# EAGLE schematic CFT-PB0-revB (EAGLE 5.11)
DRAWN_BY: Alexios; PROJECT_NAME: CFT Mini-Computer; REVISION: Rev F; SHEET_DESCRIPTION: Microcode Banking; SIMULATION_FILENAME: verification/processor-board-uC.v; URL: http://www.bedroomlan.org/cft

## Sheet 1 of 4
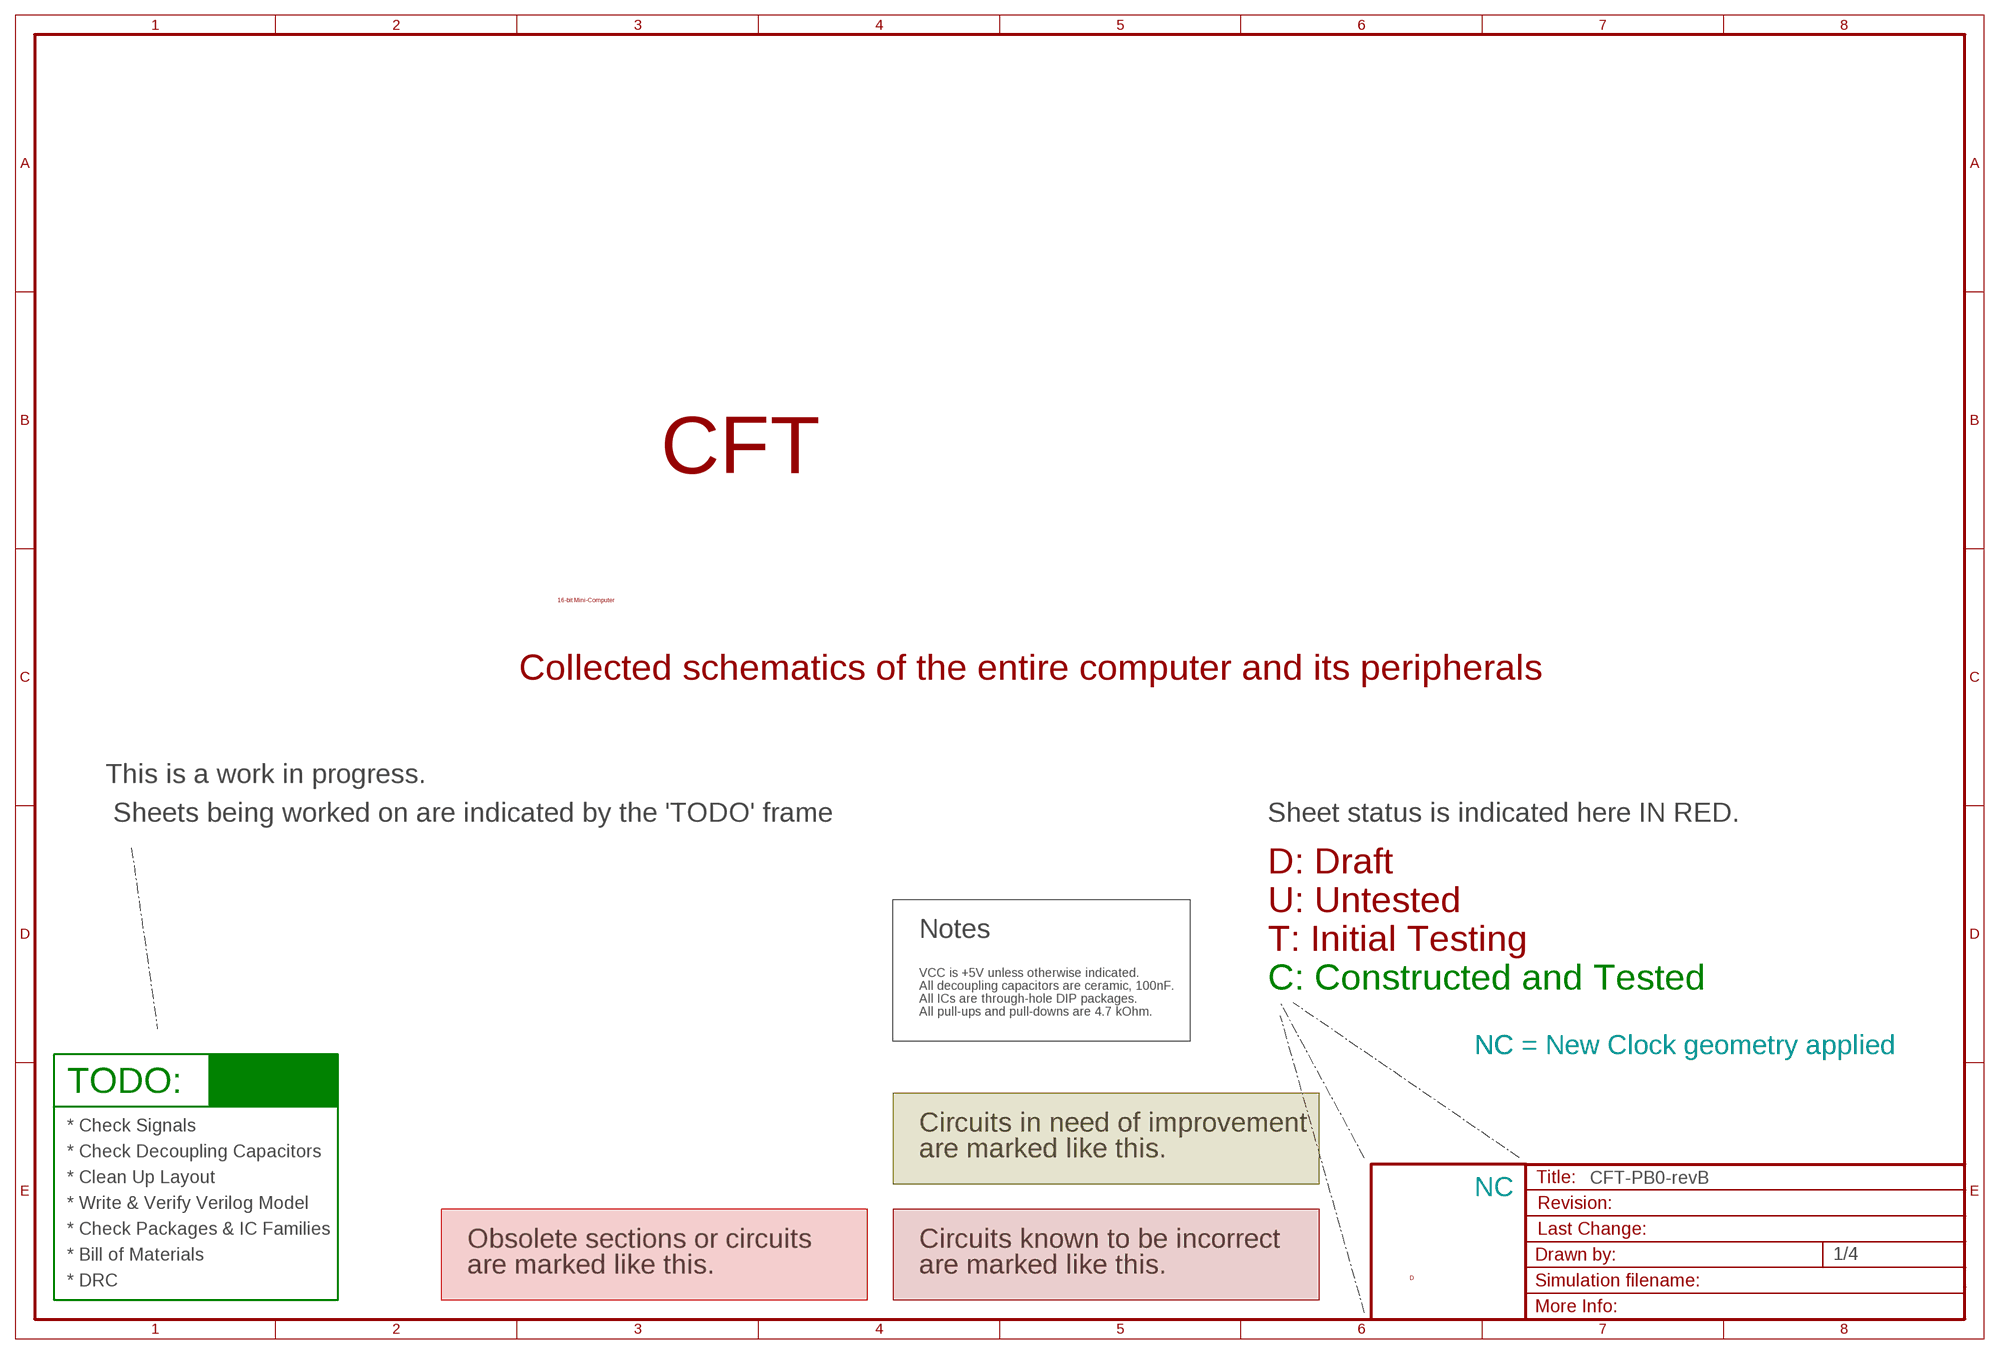
[diagram p0: schematic, sheet 1]

### Notes on the sheet
- CFT
- 16-bit Mini-Computer
- Collected schematics of the entire computer and its peripherals
- This is a work in progress.
- Sheets being worked on are indicated by the 'TODO' frame | Sheet status is indicated here IN RED.
- D: Draft
- U: Untested
- Notes
- T: Initial Testing
- VCC is +5V unless otherwise indicated.
- All decoupling capacitors are ceramic, 100nF. | C: Constructed and Tested
- All ICs are through-hole DIP packages.
- All pull-ups and pull-downs are 4.7 kOhm.
- NC | NC = New Clock geometry applied
- TODO:
- * Check Signals | Circuits in need of improvement
- * Check Decoupling Capacitors | are marked like this.
- * Clean Up Layout
- NC
- * Write & Verify Verilog Model
- * Check Packages & IC Families
- Obsolete sections or circuits | Circuits known to be incorrect
- * Bill of Materials
- are marked like this. | are marked like this.
- D
- * DRC

## Sheet 2 of 4
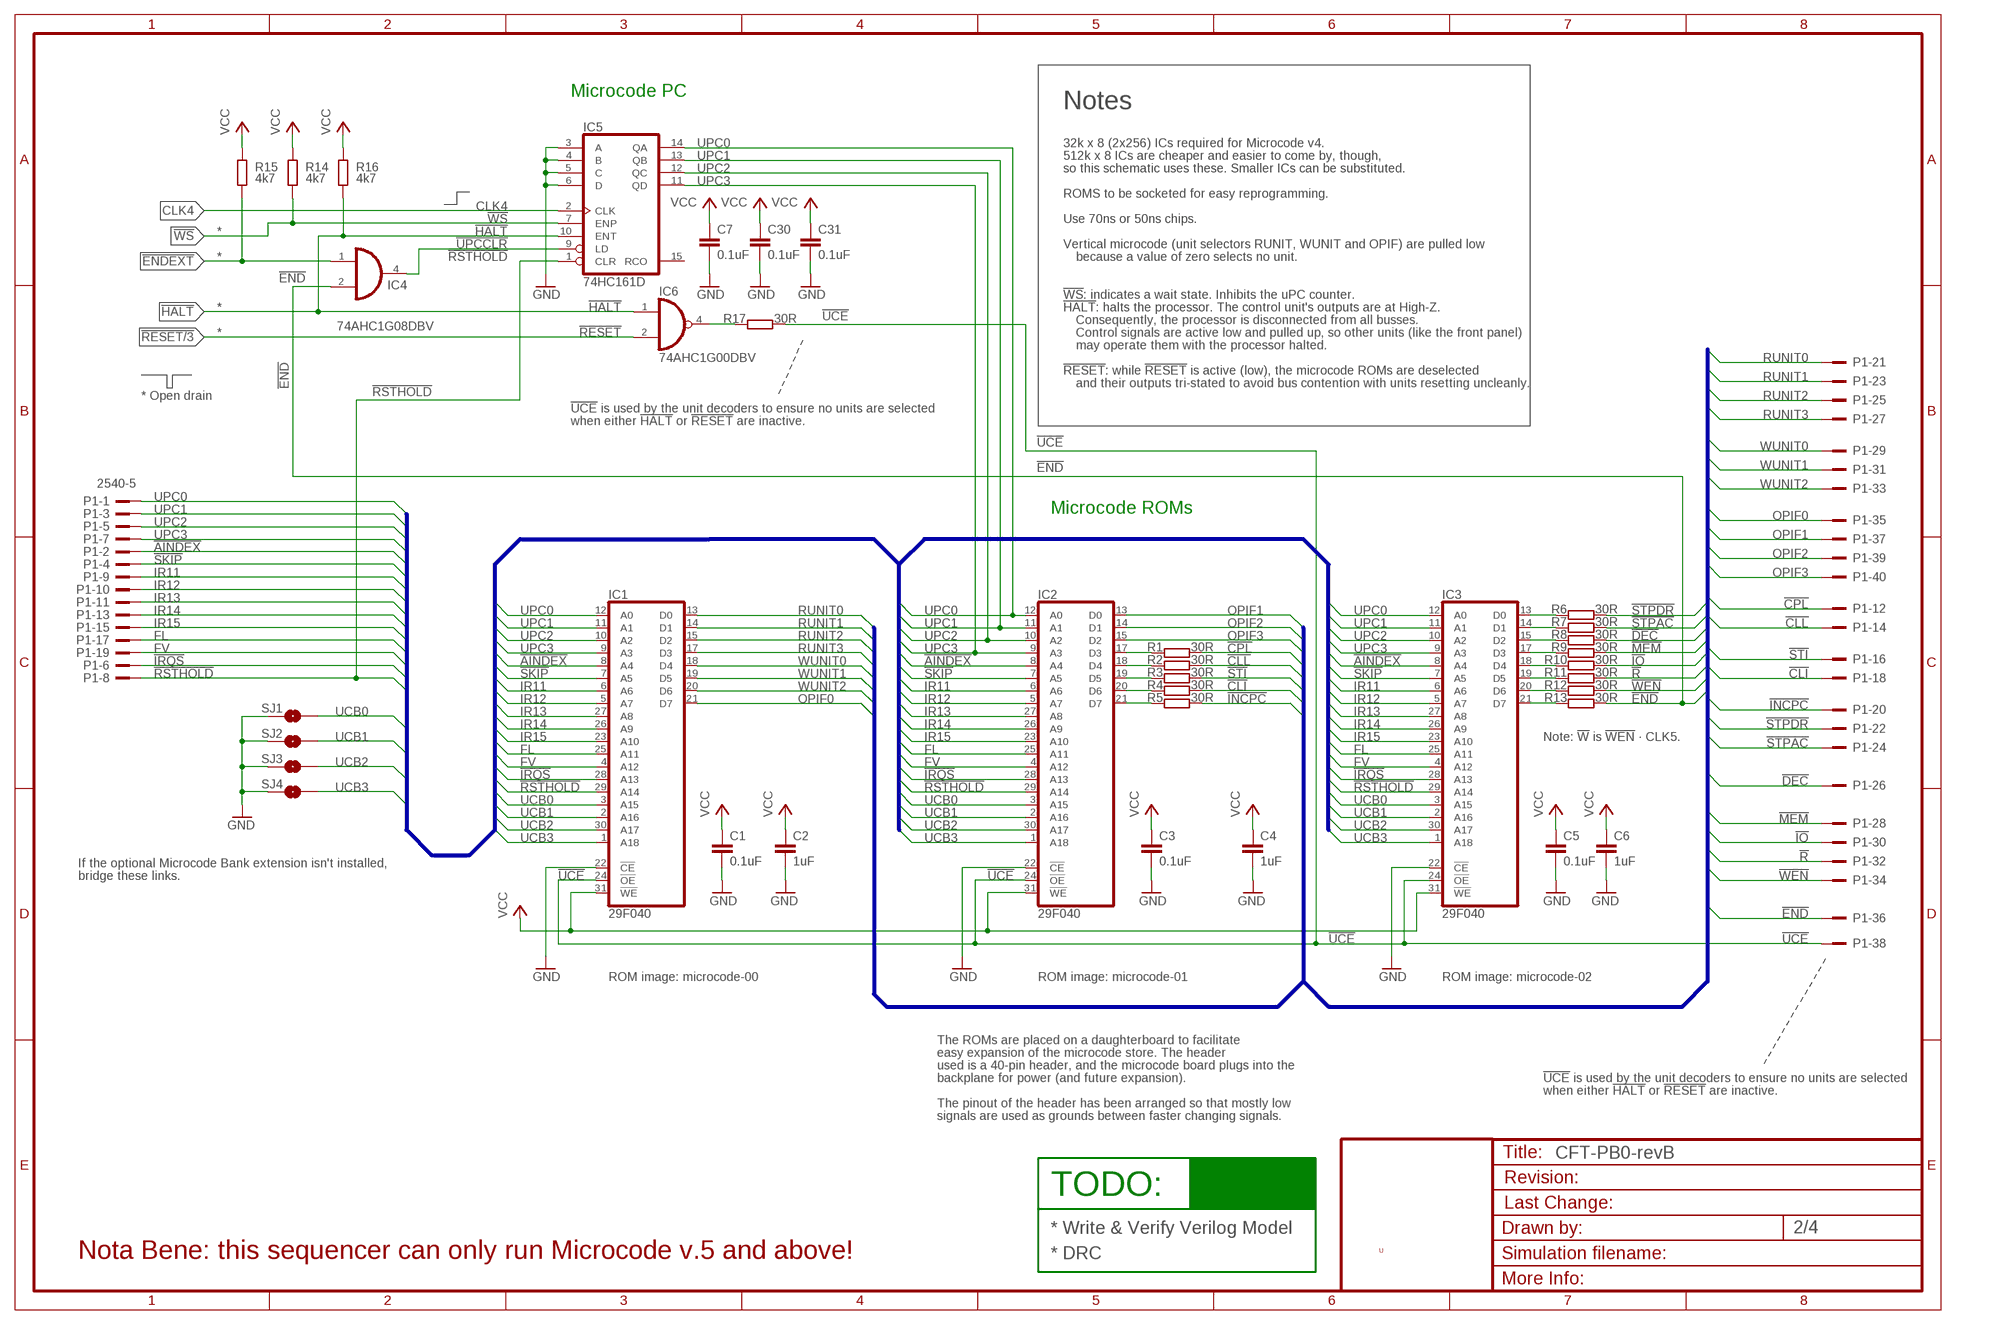
[diagram p1: schematic, sheet 2]

### Parts
C1  0.1uF  C-EUC0805K  [C0805K]
C2  1uF  C-EUC0805K  [C0805K]
C3  0.1uF  C-EUC0805K  [C0805K]
C4  1uF  C-EUC0805K  [C0805K]
C5  0.1uF  C-EUC0805K  [C0805K]
C6  1uF  C-EUC0805K  [C0805K]
C7  0.1uF  C-EUC0805K  [C0805K]
C30  0.1uF  C-EUC0805K  [C0805K]
C31  0.1uF  C-EUC0805K  [C0805K]
IC1  29F040  29F040PLCC32  [PLCC32]
IC2  29F040  29F040PLCC32  [PLCC32]
IC3  29F040  29F040PLCC32  [PLCC32]
IC4  74AHC1G08DBV  [SOT23-5]
IC5  74HC161D  [SO16D]
IC6  74AHC1G00DBV  [SOT23-5]
P1  2540-5  [PAK100/2500-5-40]
R1  30R  R-EU_R0805  [R0805]
R2  30R  R-EU_R0805  [R0805]
R3  30R  R-EU_R0805  [R0805]
R4  30R  R-EU_R0805  [R0805]
R5  30R  R-EU_R0805  [R0805]
R6  30R  R-EU_R0805  [R0805]
R7  30R  R-EU_R0805  [R0805]
R8  30R  R-EU_R0805  [R0805]
R9  30R  R-EU_R0805  [R0805]
R10  30R  R-EU_R0805  [R0805]
R11  30R  R-EU_R0805  [R0805]
R12  30R  R-EU_R0805  [R0805]
R13  30R  R-EU_R0805  [R0805]
R14  4k7  R-EU_R0805  [R0805]
R15  4k7  R-EU_R0805  [R0805]
R16  4k7  R-EU_R0805  [R0805]
R17  30R  R-EU_R0805  [R0805]
SJ1  SOLDERJUMPER-OLDNO  [SJ_2S-NO]
SJ2  SOLDERJUMPER-OLDNO  [SJ_2S-NO]
SJ3  SOLDERJUMPER-OLDNO  [SJ_2S-NO]
SJ4  SOLDERJUMPER-OLDNO  [SJ_2S-NO]

### Nets
!AINDEX: IC1.8(A4) IC2.8(A4) IC3.8(A4) P1.2 ; also sheet 4
!CLI: P1.18 R4.2 ; also sheet 4
!CLL: P1.14 R2.2 ; also sheet 4
!CPL: P1.12 R1.2 ; also sheet 4
!DEC: P1.26 R8.2 ; also sheet 4
!END: IC4.2(I1) P1.36 R13.2 ; also sheet 3,4
!ENDEXT: IC4.1(I0) R15.1 ; also sheet 4
!HALT: IC5.10(ENT) IC6.1(I0) R16.1 ; also sheet 4
!INCPC: P1.20 R5.2 ; also sheet 4
!IO: P1.30 R10.2 ; also sheet 4
!IRQS: IC1.28(A13) IC2.28(A13) IC3.28(A13) P1.6 ; also sheet 4
!MEM: P1.28 R9.2 ; also sheet 4
!R: P1.32 R11.2 ; also sheet 4
!RESET: IC6.2(I1) ; also sheet 3,4
!RSTHOLD: IC1.29(A14) IC2.29(A14) IC3.29(A14) IC5.1(CLR) P1.8 ; also sheet 4
!SKIP: IC1.7(A5) IC2.7(A5) IC3.7(A5) P1.4 ; also sheet 4
!STI: P1.16 R3.2 ; also sheet 4
!STPAC: P1.24 R7.2 ; also sheet 4
!STPDR: P1.22 R6.2 ; also sheet 4
!UCE: IC1.24(!OE) IC2.24(!OE) IC3.24(!OE) P1.38 R17.2
!UPCCLR: IC4.4(O) IC5.9(LD)
!WEN: P1.34 R12.2 ; also sheet 4
!WS: IC5.7(ENP) R14.1 ; also sheet 4
CLK4: IC5.2(CLK) ; also sheet 4
FL: IC1.25(A11) IC2.25(A11) IC3.25(A11) P1.17 ; also sheet 4
FV: IC1.4(A12) IC2.4(A12) IC3.4(A12) P1.19 ; also sheet 4
GND [low power]: C1.2 C2.2 C3.2 C4.2 C5.2 C6.2 C7.2 C30.2 C31.2 IC1.22(!CE) IC2.22(!CE) IC3.22(!CE) IC5.3(A) IC5.4(B) IC5.5(C) IC5.6(D) SJ1.1 SJ2.1 SJ3.1 SJ4.1 ; also sheet 3,4
IR11: IC1.6(A6) IC2.6(A6) IC3.6(A6) P1.9
IR12: IC1.5(A7) IC2.5(A7) IC3.5(A7) P1.10
IR13: IC1.27(A8) IC2.27(A8) IC3.27(A8) P1.11
IR14: IC1.26(A9) IC2.26(A9) IC3.26(A9) P1.13
IR15: IC1.23(A10) IC2.23(A10) IC3.23(A10) P1.15
N$45: IC6.4(O) R17.1
N$56: IC2.17(D3) R1.1
N$57: IC2.18(D4) R2.1
N$58: IC2.19(D5) R3.1
N$59: IC2.20(D6) R4.1
N$60: IC2.21(D7) R5.1
N$61: IC3.13(D0) R6.1
N$62: IC3.14(D1) R7.1
N$63: IC3.15(D2) R8.1
N$64: IC3.17(D3) R9.1
N$65: IC3.18(D4) R10.1
N$66: IC3.19(D5) R11.1
N$67: IC3.20(D6) R12.1
N$68: IC3.21(D7) R13.1
OPIF0: IC1.21(D7) P1.35 ; also sheet 4
OPIF1: IC2.13(D0) P1.37 ; also sheet 4
OPIF2: IC2.14(D1) P1.39 ; also sheet 4
OPIF3: IC2.15(D2) P1.40 ; also sheet 4
RUNIT0: IC1.13(D0) P1.21 ; also sheet 4
RUNIT1: IC1.14(D1) P1.23 ; also sheet 4
RUNIT2: IC1.15(D2) P1.25 ; also sheet 4
RUNIT3: IC1.17(D3) P1.27 ; also sheet 4
UCB0: IC1.3(A15) IC2.3(A15) IC3.3(A15) SJ1.2 ; also sheet 3,4
UCB1: IC1.2(A16) IC2.2(A16) IC3.2(A16) SJ2.2 ; also sheet 3,4
UCB2: IC1.30(A17) IC2.30(A17) IC3.30(A17) SJ3.2 ; also sheet 3,4
UCB3: IC1.1(A18) IC2.1(A18) IC3.1(A18) SJ4.2 ; also sheet 3,4
UPC0: IC1.12(A0) IC2.12(A0) IC3.12(A0) IC5.14(QA) P1.1 ; also sheet 4
UPC1: IC1.11(A1) IC2.11(A1) IC3.11(A1) IC5.13(QB) P1.3 ; also sheet 4
UPC2: IC1.10(A2) IC2.10(A2) IC3.10(A2) IC5.12(QC) P1.5 ; also sheet 4
UPC3: IC1.9(A3) IC2.9(A3) IC3.9(A3) IC5.11(QD) P1.7 ; also sheet 4
VCC [low power]: C1.1 C2.1 C3.1 C4.1 C5.1 C6.1 C7.1 C30.1 C31.1 IC1.31(!WE) IC2.31(!WE) IC3.31(!WE) R14.2 R15.2 R16.2 ; also sheet 3,4
WUNIT0: IC1.18(D4) P1.29 ; also sheet 4
WUNIT1: IC1.19(D5) P1.31 ; also sheet 4
WUNIT2: IC1.20(D6) P1.33 ; also sheet 4
Unconnected: IC5.15(RCO)

### Buses
MCINSTR:RUNIT[0..3],WUNIT[0..2],OPIF[0..3],!CPL,!CLL,!STI,!CLI,!INCPC,!STPDR,!STPAC,!DEC,!MEM,!IO,!R,!W,!END
MCADDR:UPC[0..3],!AINDEX,!SKIP,IR[11..15],FL,FV,!IRQS,!RSTHOLD,UCB[0..3]

### Notes on the sheet
- Microcode PC
- Notes
- 32k x 8 (2x256) ICs required for Microcode v4.
- 512k x 8 ICs are cheaper and easier to come by, though,
- so this schematic uses these. Smaller ICs can be substituted.
- ROMS to be socketed for easy reprogramming.
- Use 70ns or 50ns chips.
- *
- Vertical microcode (unit selectors RUNIT, WUNIT and OPIF) are pulled low
- * | because a value of zero selects no unit.
- !WS!: indicates a wait state. Inhibits the uPC counter.
- * | !HALT!: halts the processor. The control unit's outputs are at High-Z.
- Consequently, the processor is disconnected from all busses.
- * | Control signals are active low and pulled up, so other units (like the front panel)
- may operate them with the processor halted.
- !RESET!: while !RESET! is active (low), the microcode ROMs are deselected
- and their outputs tri-stated to avoid bus contention with units resetting uncleanly.
- * Open drain
- !UCE! is used by the unit decoders to ensure no units are selected
- when either !HALT! or !RESET! are inactive.
- Microcode ROMs
- Note: !W! is !WEN! · CLK5.
- If the optional Microcode Bank extension isn't installed,
- bridge these links.
- ROM image: microcode-00 | ROM image: microcode-01 | ROM image: microcode-02
- The ROMs are placed on a daughterboard to facilitate
- easy expansion of the microcode store. The header
- used is a 40-pin header, and the microcode board plugs into the
- backplane for power (and future expansion). | !UCE! is used by the unit decoders to ensure no units are selected
- when either !HALT! or !RESET! are inactive.
- The pinout of the header has been arranged so that mostly low
- signals are used as grounds between faster changing signals.
- TODO:
- * Write & Verify Verilog Model
- U
- Nota Bene: this sequencer can only run Microcode v.5 and above! | * DRC

## Sheet 3 of 4
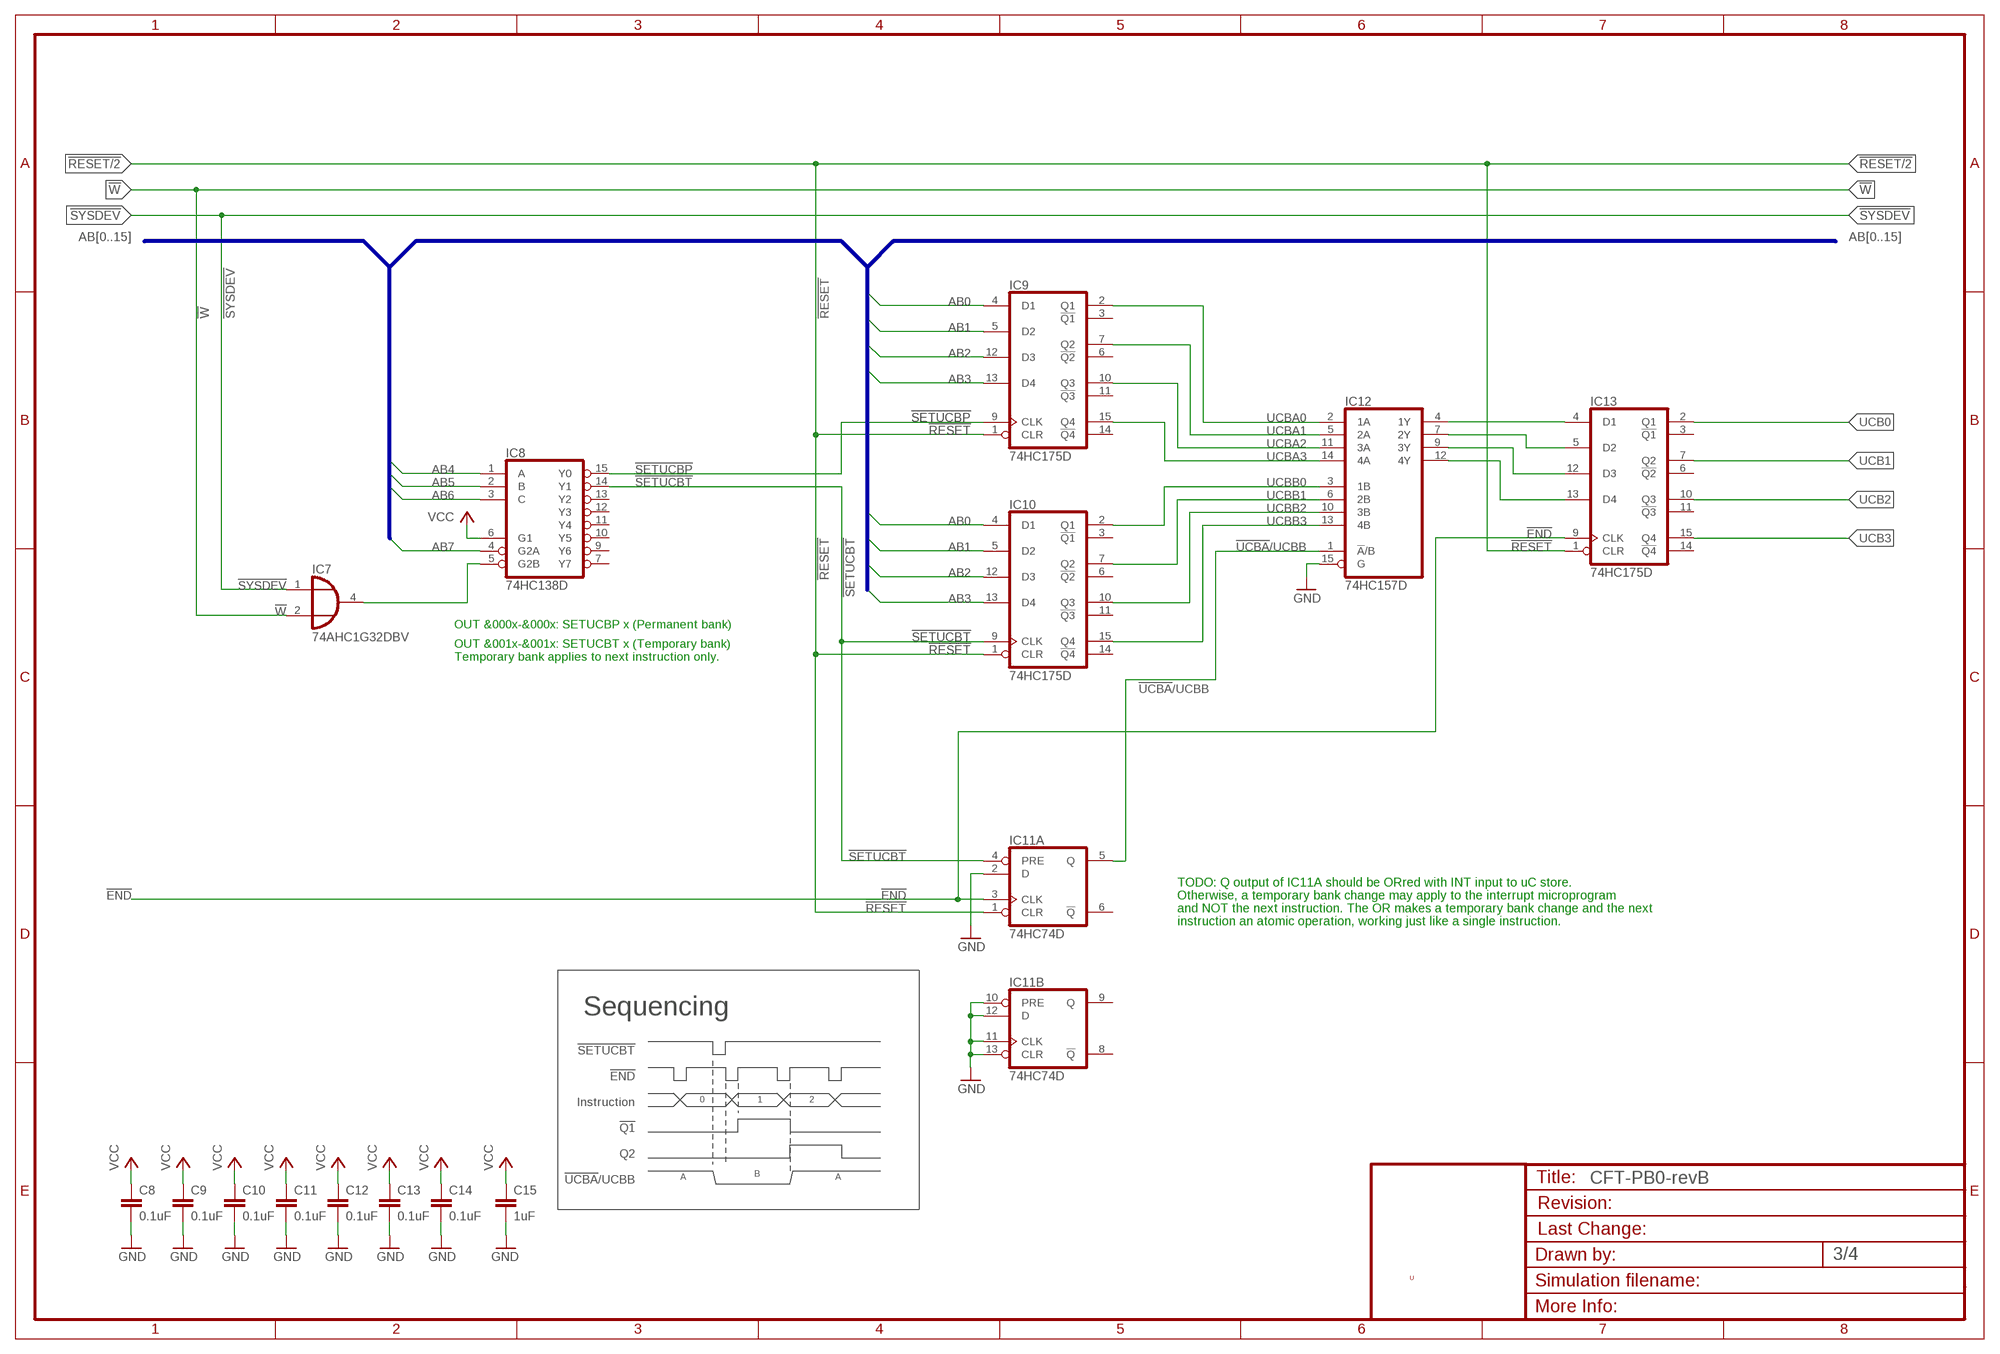
[diagram p2: schematic, sheet 3]

### Parts
C8  0.1uF  C-EUC0805K  [C0805K]
C9  0.1uF  C-EUC0805K  [C0805K]
C10  0.1uF  C-EUC0805K  [C0805K]
C11  0.1uF  C-EUC0805K  [C0805K]
C12  0.1uF  C-EUC0805K  [C0805K]
C13  0.1uF  C-EUC0805K  [C0805K]
C14  0.1uF  C-EUC0805K  [C0805K]
C15  1uF  C-EUC0805K  [C0805K]
IC7  74AHC1G32DBV  [SOT23-5]
IC8  74HC138D  [SO16]
IC9  74HC175D  [SO16]
IC10  74HC175D  [SO16]
IC11  74HC74D  [SO14]
IC12  74HC157D  74HC157/ALT-D  [SO16]
IC13  74HC175D  [SO16]

### Nets
!END: IC11.3(A:CLK) IC13.9(CLK) ; also sheet 2,4
!RESET: IC9.1(CLR) IC10.1(CLR) IC11.1(A:CLR) IC13.1(CLR) ; also sheet 2,4
!SETUCBP: IC8.15(Y0) IC9.9(CLK)
!SETUCBT: IC8.14(Y1) IC10.9(CLK) IC11.4(A:PRE)
!SYSDEV: IC7.1(I0) ; also sheet 4
!UCBA!/UCBB: IC11.5(A:Q) IC12.1(!A!/B)
!W: IC7.2(I1) ; also sheet 4
AB0: IC9.4(D1) IC10.4(D1) ; also sheet 4
AB1: IC9.5(D2) IC10.5(D2) ; also sheet 4
AB2: IC9.12(D3) IC10.12(D3) ; also sheet 4
AB3: IC9.13(D4) IC10.13(D4) ; also sheet 4
AB4: IC8.1(A) ; also sheet 4
AB5: IC8.2(B) ; also sheet 4
AB6: IC8.3(C) ; also sheet 4
AB7: IC8.4(G2A) ; also sheet 4
GND [low power]: C8.2 C9.2 C10.2 C11.2 C12.2 C13.2 C14.2 C15.2 IC11.2(A:D) IC11.10(B:PRE) IC11.11(B:CLK) IC11.12(B:D) IC11.13(B:CLR) IC12.15(G) ; also sheet 2,4
N$1: IC7.4(O) IC8.5(G2B)
N$2: IC12.4(1Y) IC13.4(D1)
N$3: IC12.7(2Y) IC13.5(D2)
N$4: IC12.9(3Y) IC13.12(D3)
N$5: IC12.12(4Y) IC13.13(D4)
UCB0: IC13.2(Q1) ; also sheet 2,4
UCB1: IC13.7(Q2) ; also sheet 2,4
UCB2: IC13.10(Q3) ; also sheet 2,4
UCB3: IC13.15(Q4) ; also sheet 2,4
UCBA0: IC9.2(Q1) IC12.2(1A)
UCBA1: IC9.7(Q2) IC12.5(2A)
UCBA2: IC9.10(Q3) IC12.11(3A)
UCBA3: IC9.15(Q4) IC12.14(4A)
UCBB0: IC10.2(Q1) IC12.3(1B)
UCBB1: IC10.7(Q2) IC12.6(2B)
UCBB2: IC10.10(Q3) IC12.10(3B)
UCBB3: IC10.15(Q4) IC12.13(4B)
VCC [low power]: C8.1 C9.1 C10.1 C11.1 C12.1 C13.1 C14.1 C15.1 IC8.6(G1) ; also sheet 2,4
Unconnected: IC8.7(Y7) IC8.9(Y6) IC8.10(Y5) IC8.11(Y4) IC8.12(Y3) IC8.13(Y2) IC9.3(!Q1) IC9.6(!Q2) IC9.11(!Q3) IC9.14(!Q4) IC10.3(!Q1) IC10.6(!Q2) IC10.11(!Q3) IC10.14(!Q4) IC11.6(A:!Q) IC11.8(B:!Q) IC11.9(B:Q) IC13.3(!Q1) IC13.6(!Q2) IC13.11(!Q3) IC13.14(!Q4)

### Buses
AB[0..15]

### Notes on the sheet
- OUT &000x-&000x: SETUCBP x (Permanent bank)
- OUT &001x-&001x: SETUCBT x (Temporary bank)
- Temporary bank applies to next instruction only.
- TODO: Q output of IC11A should be ORred with INT input to uC store.
- Otherwise, a temporary bank change may apply to the interrupt microprogram
- and NOT the next instruction. The OR makes a temporary bank change and the next
- instruction an atomic operation, working just like a single instruction.
- Sequencing
- !SETUCBT
- !END
- 0 | 1 | 2
- Instruction
- !Q1
- Q2
- B
- A | A
- !UCBA!/UCBB
- U

## Sheet 4 of 4
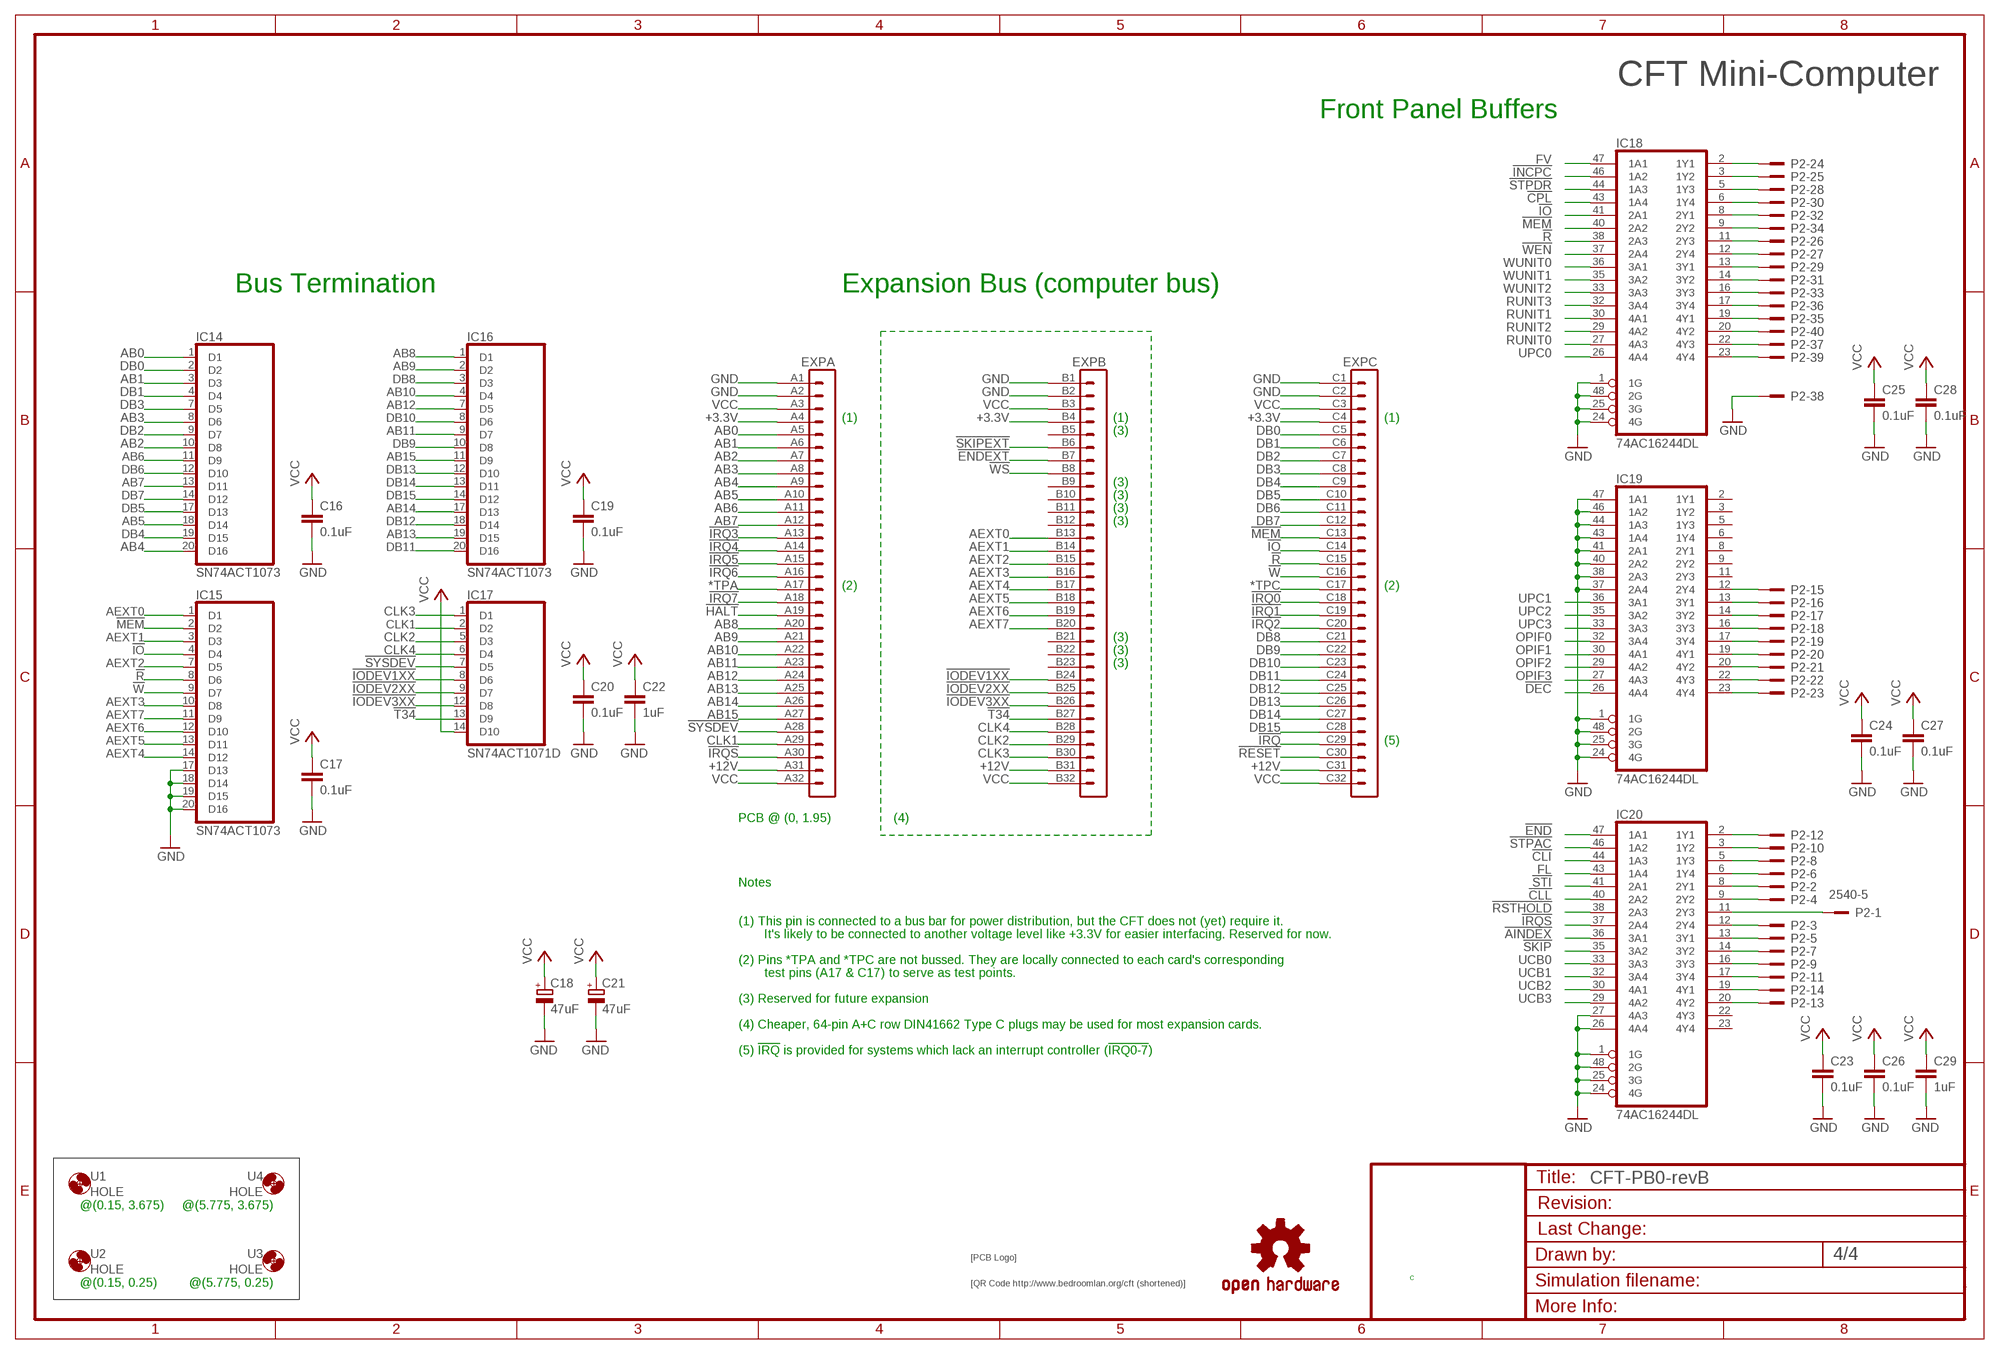
[diagram p3: schematic, sheet 4]

### Parts
$4_37_$  SIGNATURESILK  [SIGNATURE]
$4_39_$  OSHW-LOGOL  [OSHW-LOGO-L]
$4_40_$  QRCODE-CFT  [CFT-QRCODE]
C16  0.1uF  C-EUC0805K  [C0805K]
C17  0.1uF  C-EUC0805K  [C0805K]
C18  47uF  CPOL-EUE2.5-5  [E2,5-5]
C19  0.1uF  C-EUC0805K  [C0805K]
C20  0.1uF  C-EUC0805K  [C0805K]
C21  47uF  CPOL-EUE2.5-5  [E2,5-5]
C22  1uF  C-EUC0805K  [C0805K]
C23  0.1uF  C-EUC0805K  [C0805K]
C24  0.1uF  C-EUC0805K  [C0805K]
C25  0.1uF  C-EUC0805K  [C0805K]
C26  0.1uF  C-EUC0805K  [C0805K]
C27  0.1uF  C-EUC0805K  [C0805K]
C28  0.1uF  C-EUC0805K  [C0805K]
C29  1uF  C-EUC0805K  [C0805K]
EXP  VG96-3K  [VG96K]
IC14  SN74ACT1073  [SO20W]
IC15  SN74ACT1073  [SO20W]
IC16  SN74ACT1073  [SO20W]
IC17  SN74ACT1071D  [SO14]
IC18  74AC16244DL  [SSOP48DL]
IC19  74AC16244DL  [SSOP48DL]
IC20  74AC16244DL  [SSOP48DL]
P2  2540-5  [PAK100/2500-5-40]
U1  HOLE  [STANDOFF_28_60]
U2  HOLE  [STANDOFF_28_60]
U3  HOLE  [STANDOFF_28_60]
U4  HOLE  [STANDOFF_28_60]

### Nets
!AINDEX: IC20.36(3A1) ; also sheet 2
!CLI: IC20.44(1A3) ; also sheet 2
!CLL: IC20.40(2A2) ; also sheet 2
!CPL: IC18.43(1A4) ; also sheet 2
!DEC: IC19.26(4A4) ; also sheet 2
!END: IC20.47(1A1) ; also sheet 2,3
!ENDEXT: EXP.B7 ; also sheet 2
!HALT: EXP.A19 ; also sheet 2
!INCPC: IC18.46(1A2) ; also sheet 2
!IO: EXP.C14 IC15.4(D4) IC18.41(2A1) ; also sheet 2
!IODEV1XX: EXP.B24 IC17.8(D6)
!IODEV2XX: EXP.B25 IC17.9(D7)
!IODEV3XX: EXP.B26 IC17.12(D8)
!IRQ: EXP.C29
!IRQ0: EXP.C18
!IRQ1: EXP.C19
!IRQ2: EXP.C20
!IRQ3: EXP.A13
!IRQ4: EXP.A14
!IRQ5: EXP.A15
!IRQ6: EXP.A16
!IRQ7: EXP.A18
!IRQS: EXP.A30 IC20.37(2A4) ; also sheet 2
!MEM: EXP.C13 IC15.2(D2) IC18.40(2A2) ; also sheet 2
!R: EXP.C15 IC15.8(D6) IC18.38(2A3) ; also sheet 2
!RESET: EXP.C30 ; also sheet 2,3
!RSTHOLD: IC20.38(2A3) ; also sheet 2
!SKIP: IC20.35(3A2) ; also sheet 2
!SKIPEXT: EXP.B6
!STI: IC20.41(2A1) ; also sheet 2
!STPAC: IC20.46(1A2) ; also sheet 2
!STPDR: IC18.44(1A3) ; also sheet 2
!SYSDEV: EXP.A28 IC17.7(D5) ; also sheet 3
!T34: EXP.B27 IC17.13(D9)
!W: EXP.C16 IC15.9(D7) ; also sheet 3
!WEN: IC18.37(2A4) ; also sheet 2
!WS: EXP.B8 ; also sheet 2
*TPA: EXP.A17
*TPC: EXP.C17
+3.3V: EXP.A4 EXP.B4 EXP.C4
+12V [LED power]: EXP.A31 EXP.B31 EXP.C31
AB0: EXP.A5 IC14.1(D1) ; also sheet 3
AB1: EXP.A6 IC14.3(D3) ; also sheet 3
AB2: EXP.A7 IC14.10(D8) ; also sheet 3
AB3: EXP.A8 IC14.8(D6) ; also sheet 3
AB4: EXP.A9 IC14.20(D16) ; also sheet 3
AB5: EXP.A10 IC14.18(D14) ; also sheet 3
AB6: EXP.A11 IC14.11(D9) ; also sheet 3
AB7: EXP.A12 IC14.13(D11) ; also sheet 3
AB8: EXP.A20 IC16.1(D1)
AB9: EXP.A21 IC16.2(D2)
AB10: EXP.A22 IC16.4(D4)
AB11: EXP.A23 IC16.9(D7)
AB12: EXP.A24 IC16.7(D5)
AB13: EXP.A25 IC16.19(D15)
AB14: EXP.A26 IC16.17(D13)
AB15: EXP.A27 IC16.11(D9)
AEXT0: EXP.B13 IC15.1(D1)
AEXT1: EXP.B14 IC15.3(D3)
AEXT2: EXP.B15 IC15.7(D5)
AEXT3: EXP.B16 IC15.10(D8)
AEXT4: EXP.B17 IC15.14(D12)
AEXT5: EXP.B18 IC15.13(D11)
AEXT6: EXP.B19 IC15.12(D10)
AEXT7: EXP.B20 IC15.11(D9)
CLK1: EXP.A29 IC17.2(D2)
CLK2: EXP.B29 IC17.5(D3)
CLK3: EXP.B30 IC17.1(D1)
CLK4: EXP.B28 IC17.6(D4) ; also sheet 2
DB0: EXP.C5 IC14.2(D2)
DB1: EXP.C6 IC14.4(D4)
DB2: EXP.C7 IC14.9(D7)
DB3: EXP.C8 IC14.7(D5)
DB4: EXP.C9 IC14.19(D15)
DB5: EXP.C10 IC14.17(D13)
DB6: EXP.C11 IC14.12(D10)
DB7: EXP.C12 IC14.14(D12)
DB8: EXP.C21 IC16.3(D3)
DB9: EXP.C22 IC16.10(D8)
DB10: EXP.C23 IC16.8(D6)
DB11: EXP.C24 IC16.20(D16)
DB12: EXP.C25 IC16.18(D14)
DB13: EXP.C26 IC16.12(D10)
DB14: EXP.C27 IC16.13(D11)
DB15: EXP.C28 IC16.14(D12)
FL: IC20.43(1A4) ; also sheet 2
FV: IC18.47(1A1) ; also sheet 2
GND [low power]: C16.2 C17.2 C18.- C19.2 C20.2 C21.- C22.2 C23.2 C24.2 C25.2 C26.2 C27.2 C28.2 C29.2 EXP.A1 EXP.A2 EXP.B1 EXP.B2 EXP.C1 EXP.C2 IC15.17(D13) IC15.18(D14) IC15.19(D15) IC15.20(D16) IC18.1(1G) IC18.24(4G) IC18.25(3G) IC18.48(2G) IC19.1(1G) IC19.24(4G) IC19.25(3G) IC19.37(2A4) IC19.38(2A3) IC19.40(2A2) IC19.41(2A1) IC19.43(1A4) IC19.44(1A3) IC19.46(1A2) IC19.47(1A1) IC19.48(2G) IC20.1(1G) IC20.24(4G) IC20.25(3G) IC20.26(4A4) IC20.27(4A3) IC20.48(2G) P2.38 ; also sheet 2,3
N$6: IC18.23(4Y4) P2.39
N$7: IC18.22(4Y3) P2.37
N$8: IC18.20(4Y2) P2.40
N$9: IC18.19(4Y1) P2.35
N$10: IC20.2(1Y1) P2.12
N$11: IC20.3(1Y2) P2.10
N$12: IC20.9(2Y2) P2.4
N$13: IC20.8(2Y1) P2.2
N$14: IC20.6(1Y4) P2.6
N$15: IC20.5(1Y3) P2.8
N$16: IC20.11(2Y3) P2.1
N$17: IC20.12(2Y4) P2.3
N$18: IC20.13(3Y1) P2.5
N$19: IC20.14(3Y2) P2.7
N$20: IC20.16(3Y3) P2.9
N$21: IC20.17(3Y4) P2.11
N$22: IC20.20(4Y2) P2.13
N$23: IC20.19(4Y1) P2.14
N$24: IC18.17(3Y4) P2.36
N$25: IC18.16(3Y3) P2.33
N$26: IC18.14(3Y2) P2.31
N$27: IC18.13(3Y1) P2.29
N$28: IC18.12(2Y4) P2.27
N$29: IC18.11(2Y3) P2.26
N$30: IC18.9(2Y2) P2.34
N$31: IC18.8(2Y1) P2.32
N$32: IC18.6(1Y4) P2.30
N$33: IC18.5(1Y3) P2.28
N$34: IC18.3(1Y2) P2.25
N$35: IC18.2(1Y1) P2.24
N$36: IC19.23(4Y4) P2.23
N$37: IC19.22(4Y3) P2.22
N$38: IC19.20(4Y2) P2.21
N$39: IC19.19(4Y1) P2.20
N$40: IC19.17(3Y4) P2.19
N$41: IC19.16(3Y3) P2.18
N$42: IC19.14(3Y2) P2.17
N$43: IC19.13(3Y1) P2.16
N$44: IC19.12(2Y4) P2.15
OPIF0: IC19.32(3A4) ; also sheet 2
OPIF1: IC19.30(4A1) ; also sheet 2
OPIF2: IC19.29(4A2) ; also sheet 2
OPIF3: IC19.27(4A3) ; also sheet 2
RUNIT0: IC18.27(4A3) ; also sheet 2
RUNIT1: IC18.30(4A1) ; also sheet 2
RUNIT2: IC18.29(4A2) ; also sheet 2
RUNIT3: IC18.32(3A4) ; also sheet 2
UCB0: IC20.33(3A3) ; also sheet 2,3
UCB1: IC20.32(3A4) ; also sheet 2,3
UCB2: IC20.30(4A1) ; also sheet 2,3
UCB3: IC20.29(4A2) ; also sheet 2,3
UPC0: IC18.26(4A4) ; also sheet 2
UPC1: IC19.36(3A1) ; also sheet 2
UPC2: IC19.35(3A2) ; also sheet 2
UPC3: IC19.33(3A3) ; also sheet 2
VCC [low power]: C16.1 C17.1 C18.+ C19.1 C20.1 C21.+ C22.1 C23.1 C24.1 C25.1 C26.1 C27.1 C28.1 C29.1 EXP.A3 EXP.A32 EXP.B3 EXP.B32 EXP.C3 EXP.C32 IC17.14(D10) ; also sheet 2,3
WUNIT0: IC18.36(3A1) ; also sheet 2
WUNIT1: IC18.35(3A2) ; also sheet 2
WUNIT2: IC18.33(3A3) ; also sheet 2
Unconnected: EXP.B5 EXP.B9 EXP.B10 EXP.B11 EXP.B12 EXP.B21 EXP.B22 EXP.B23 IC19.2(1Y1) IC19.3(1Y2) IC19.5(1Y3) IC19.6(1Y4) IC19.8(2Y1) IC19.9(2Y2) IC19.11(2Y3) IC20.22(4Y3) IC20.23(4Y4)

### Notes on the sheet
- CFT Mini-Computer
- Front Panel Buffers
- Bus Termination | Expansion Bus (computer bus)
- (1) | (1) | (1)
- (3)
- (3)
- (3)
- (3)
- (3)
- (2) | (2)
- (3)
- (3)
- (3)
- (5)
- PCB @ (0, 1.95) | (4)
- Notes
- (1) This pin is connected to a bus bar for power distribution, but the CFT does not (yet) require it.
- It's likely to be connected to another voltage level like +3.3V for easier interfacing. Reserved for now.
- (2) Pins *TPA and *TPC are not bussed. They are locally connected to each card's corresponding
- test pins (A17 & C17) to serve as test points.
- (3) Reserved for future expansion
- (4) Cheaper, 64-pin A+C row DIN41662 Type C plugs may be used for most expansion cards.
- (5) !IRQ! is provided for systems which lack an interrupt controller (!IRQ0-7!)
- @(0.15, 3.675) | @(5.775, 3.675)
- C
- @(0.15, 0.25) | @(5.775, 0.25)

## Power pins joined to a net without a drawn wire
GND: IC1.16(GND) IC2.16(GND) IC3.16(GND) IC4.3(GND) IC5.8(GND) IC6.3(GND) IC7.3(GND) IC8.8(GND) IC9.8(GND) IC10.8(GND) IC11.7(P:GND) IC12.8(GND) IC13.8(GND) IC14.5(GND) IC14.6(GND) IC15.5(GND) IC15.6(GND) IC16.5(GND) IC16.6(GND) IC17.3(GND) IC17.4(GND) IC18.4(GND) IC18.10(GND) IC18.15(GND) IC18.21(GND) IC18.28(GND) IC18.34(GND) IC18.39(GND) IC18.45(GND) IC19.4(GND) IC19.10(GND) IC19.15(GND) IC19.21(GND) IC19.28(GND) IC19.34(GND) IC19.39(GND) IC19.45(GND) IC20.4(GND) IC20.10(GND) IC20.15(GND) IC20.21(GND) IC20.28(GND) IC20.34(GND) IC20.39(GND) IC20.45(GND)
VCC: IC1.32(VCC) IC2.32(VCC) IC3.32(VCC) IC4.5(VCC) IC5.16(VCC) IC6.5(VCC) IC7.5(VCC) IC8.16(VCC) IC9.16(VCC) IC10.16(VCC) IC11.14(P:VCC) IC12.16(VCC) IC13.16(VCC) IC14.15(VCC) IC14.16(VCC) IC15.15(VCC) IC15.16(VCC) IC16.15(VCC) IC16.16(VCC) IC17.10(VCC) IC17.11(VCC) IC18.7(VCC) IC18.18(VCC) IC18.31(VCC) IC18.42(VCC) IC19.7(VCC) IC19.18(VCC) IC19.31(VCC) IC19.42(VCC) IC20.7(VCC) IC20.18(VCC) IC20.31(VCC) IC20.42(VCC)

## Library data of the parts
$4_37_$ = alexios:SIGNATURE: Soup signature
$4_39_$ = SparkFun:OSHW-LOGO: Open Source Hardware Logo This logo indicates the piece of hardware it is found on incorporates a OSHW license and/or adheres to the definition of open source hardware found here: http://freedomdefined.org/OSHW
$4_40_$ = alexios:QRCODE-*: Various QR codes in silkscreen.
C1-C17 C19 C20 C22-C31 = rcl:C-EU: CAPACITOR, European symbol
C18 C21 = rcl:CPOL-EU: POLARIZED CAPACITOR, European symbol
EXP = alexios-19inch:VG96-3: PCB EUROCARD, 96-pin type C/ABC, 2.54 mm
IC1-IC3 = alexios:29F040: 4-mbit (512x8) Flash memory in a PLCC32 package (with socket). AM29F040 is an example of this.
IC4 = alexios:74*1G08: 2-input AND gate
IC5 = alexios:74*161: 4-Bit Synchronous Binary Counter. 4-bit synchronous binary counter with asynchronous reset. The ?AC163 devices are 4-bit binary counters. These synchronous, presettable counters feature an internal carry look-ahead for application in high-speed counting designs. Synchronous operation is provided by having all flip-flops clocked simultaneously so that the outputs change, coincident with each other, when instructed by the count-enable (ENP, ENT) inputs and internal gating.
IC6 = alexios:74*1G00: 2-input NAND gate
IC7 = alexios:74*1G32: 2-input OR gate
IC8 = alexios:74*138: 3-line to 8-line DECODER/DEMULTIPLEXER
IC9 IC10 IC13 = alexios:74*175: Qadruple D type FLIP FLOP, clear
IC11 = alexios:74*74: Dual D type positive edge triggered FLIP FLOP, preset and clear
IC12 = alexios:74*157/ALT-: Quadruple 2-line to 1-line data SELECTOR/MULTIPLEXER
IC14-IC16 = alexios:SN74ACT1073: SN74ACT1073 16-Bit Bus-Termination Array with Bus-Hold Function Datasheet <http://www.ti.com/lit/ds/symlink/sn74act1073.pdf>
IC17 = alexios:SN74ACT1071: 10-BIT BUS-TERMINATION ARRAY WITH BUS-HOLD FUNCTION Datasheet: http://www.ti.com/lit/ds/scas192/scas192.pdf
IC18-IC20 = alexios:74*16244: 16-bit BUFFER/LINE DRIVER, 3-state Datasheet <http://www.ti.com/lit/ds/scds168/scds168.pdf>
P1 P2 = con-3m:2540-: 3M (TM) Pak 100 4-Wall Header Source: 3M; OC_FARNELL: 9838414; OC_NEWARK: unknown
R1-R13 R17 = rcl:R-EU_: RESISTOR, European symbol
R14-R16 = resistor:R-EU_: RESISTOR, European symbol
SJ1-SJ4 = SparkFun:SOLDERJUMPER-OLD: Solder Jumper Standard SMD solder jumper. Used to automate production. Two varients : Normally Open and Normally Closed are the same, but have different paste layers. NC will have a large amount of paste and should jumper during reflow.
U1-U4 = alexios:HOLE: Hole for a standoff or mount. Hole diameter: 3.3mm. External Diameter: 6mm. Suitable for M3 standoffs.

## Net classes
0 default: width 0.203 mm, clearance 0.152 mm
1 low power: width 0.203 mm, clearance 0.152 mm
2 LED power: width 1.93 mm, clearance 0.152 mm